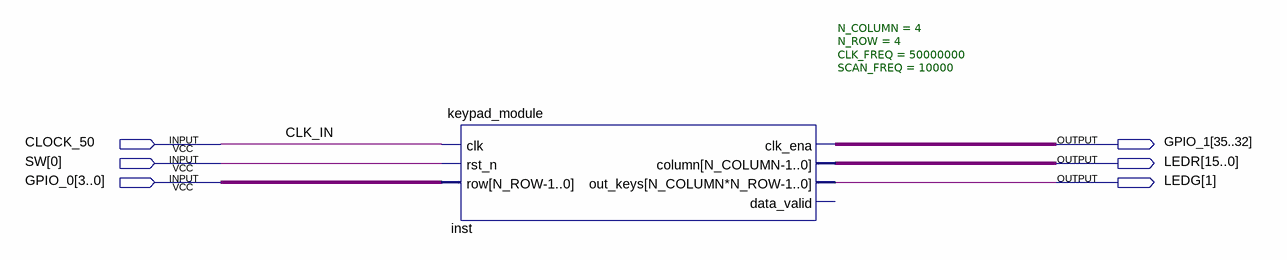
[diagram p0: schematic sheet]
// Quartus schematic keypad.bdf as structural Verilog: 1 symbols, 6 pins
module keypad (
  input  CLOCK_50,
  input  [0:0] SW,
  input  [3:0] GPIO_0,
  output [35:32] GPIO_1,
  output [15:0] LEDR,
  output [1:1] LEDG
);

  keypad_module #(.N_COLUMN(4), .N_ROW(4), .CLK_FREQ(50000000), .SCAN_FREQ(10000)) inst (
    .clk(CLOCK_50), .rst_n(SW[0]), .row(GPIO_0), .clk_ena(GPIO_1), .column(LEDR), .out_keys(LEDG[1]));  // open: data_valid

  // Other names for the same wires on the sheet: CLK_IN = CLOCK_50
endmodule
